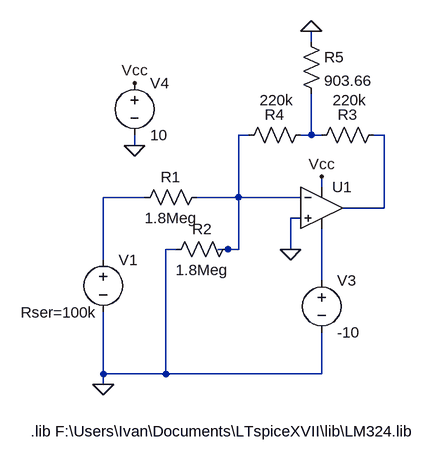
[diagram p0: schematic TP2_MORALES_SUAREZ_TORRES.asc]
TP2_MORALES_SUAREZ_TORRES.asc, the LTspice schematic file:
Version 4
SHEET 1 1072 680
WIRE 496 -64 496 -80
WIRE 400 80 384 80
WIRE 496 80 496 16
WIRE 496 80 480 80
WIRE 512 80 496 80
WIRE 608 80 592 80
WIRE 224 96 224 80
WIRE 512 160 512 144
WIRE 240 176 176 176
WIRE 384 176 384 80
WIRE 384 176 320 176
WIRE 480 176 384 176
WIRE 608 192 608 80
WIRE 608 192 544 192
WIRE 480 208 464 208
WIRE 288 256 272 256
WIRE 368 256 352 256
WIRE 384 256 384 176
WIRE 384 256 368 256
WIRE 464 256 464 208
WIRE 176 272 176 176
WIRE 512 304 512 224
WIRE 176 448 176 352
WIRE 272 448 272 256
WIRE 272 448 176 448
WIRE 512 448 512 384
WIRE 512 448 272 448
WIRE 176 464 176 448
FLAG 224 96 0
FLAG 224 0 Vcc
FLAG 512 144 Vcc
FLAG 176 464 0
FLAG 496 -80 0
FLAG 464 256 0
SYMBOL res 336 160 R90
WINDOW 0 0 56 VBottom 2
WINDOW 3 32 56 VTop 2
SYMATTR InstName R1
SYMATTR Value 1.8Meg
SYMBOL res 384 240 R90
WINDOW 0 0 56 VBottom 2
WINDOW 3 32 56 VTop 2
SYMATTR InstName R2
SYMATTR Value 1.8Meg
SYMBOL voltage 512 288 R0
WINDOW 123 0 0 Left 0
WINDOW 39 0 0 Left 0
SYMATTR InstName V3
SYMATTR Value -10
SYMBOL res 496 64 R90
WINDOW 0 0 56 VBottom 2
WINDOW 3 -53 53 VTop 2
SYMATTR InstName R4
SYMATTR Value 220k
SYMBOL voltage 224 -16 R0
WINDOW 123 0 0 Left 0
WINDOW 39 0 0 Left 0
SYMATTR InstName V4
SYMATTR Value 10
SYMBOL OpAmps\\UniversalOpAmp 512 192 R0
SYMATTR InstName U1
SYMBOL res 608 64 R90
WINDOW 0 0 56 VBottom 2
WINDOW 3 -53 53 VTop 2
SYMATTR InstName R3
SYMATTR Value 220k
SYMBOL res 480 -80 R0
SYMATTR InstName R5
SYMATTR Value 903.66
SYMBOL voltage 176 256 R0
WINDOW 123 0 0 Left 0
WINDOW 39 -127 97 Left 2
SYMATTR InstName V1
SYMATTR Value ""
SYMATTR SpiceLine Rser=100k
TEXT 64 536 Left 2 !.lib F:\\Users\\Ivan\\Documents\\LTspiceXVII\\lib\\LM324.lib

The netlist it stands for:
* TP2_MORALES_SUAREZ_TORRES.asc
R1 N001 N004 1.8Meg
R2 N001 0 1.8Meg
V3 N005 0 -10
R4 N002 N001 220k
V4 Vcc 0 10
XU1 0 N001 Vcc N005 N003 level1 Avol=1Meg GBW=10Meg Vos=0 En=0 Enk=0 In=0 Ink=0 Rin=500Meg  ; pins In+ In- V+ V- OUT
R3 N003 N002 220k
R5 0 N002 903.66
V1 N004 0 Rser=100k
.lib F:\Users\Ivan\Documents\LTspiceXVII\lib\LM324.lib
.lib UniversalOpAmp1.lib
.backanno
.end